# Altium schematic sheet Principal.SCHDOC
size A4
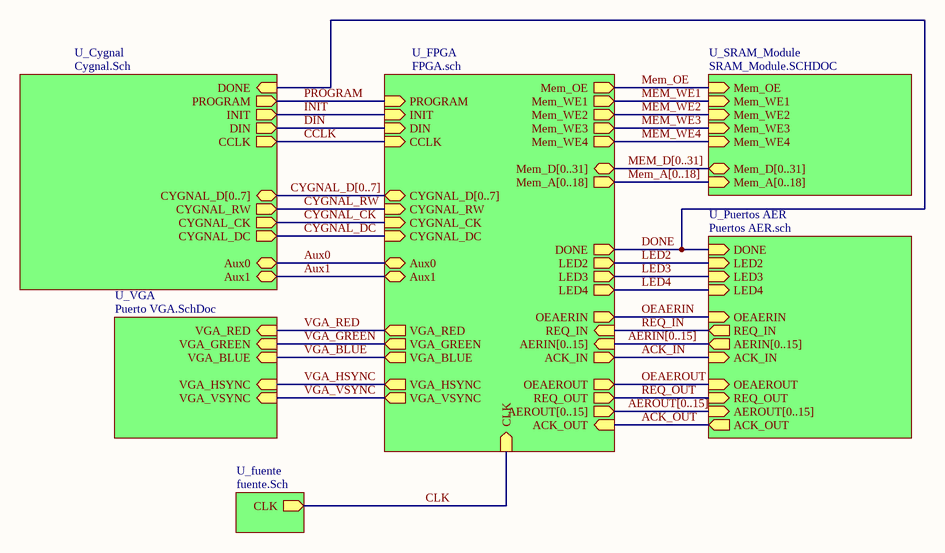
[diagram p0: Principal.SCHDOC]

## Sub-sheets
U_Cygnal = Cygnal.Sch: CYGNAL_D[0..7] (bidir), CYGNAL_RW (out), PROGRAM (out), INIT (out), CYGNAL_CK (out), CYGNAL_DC (out), DIN (out), CCLK (out), DONE (in), Aux0 (bidir), Aux1 (bidir)
U_FPGA = FPGA.sch: ACK_IN (out), REQ_IN (in), REQ_OUT (out), ACK_OUT (in), OEAEROUT (out), LED2 (out), LED3 (out), LED4 (out), PROGRAM (in), AERIN[0..15] (in), AEROUT[0..15] (out), CLK (in), INIT (in), OEAERIN (out), Mem_WE1 (out), Mem_OE (out), CYGNAL_D[0..7] (bidir), Mem_WE2 (out), Mem_WE3 (out), Mem_WE4 (out), CYGNAL_RW (in), CYGNAL_CK (in), CYGNAL_DC (in), Mem_D[0..31] (bidir), Mem_A[0..18] (out), CCLK (in), DONE (out), DIN (in), Aux0 (bidir), Aux1 (bidir), VGA_RED (out), VGA_GREEN (out), VGA_HSYNC (out), VGA_VSYNC (out), VGA_BLUE (out)
U_fuente = fuente.Sch: CLK (out)
U_Puertos AER = Puertos AER.sch: AERIN[0..15] (out), AEROUT[0..15] (in), DONE (in), LED2 (in), LED3 (in), LED4 (in), OEAERIN (in), OEAEROUT (in), ACK_IN (in), REQ_OUT (in), REQ_IN (out), ACK_OUT (out)
U_SRAM_Module = SRAM_Module.SCHDOC: Mem_WE1 (in), Mem_OE (in), Mem_A[0..18] (in), Mem_D[0..31] (bidir), Mem_WE2 (in), Mem_WE3 (in), Mem_WE4 (in)
U_VGA = Puerto VGA.SchDoc: VGA_HSYNC (in), VGA_RED (in), VGA_VSYNC (in), VGA_GREEN (in), VGA_BLUE (in)

## Nets
ACK_IN: sheet U_FPGA/ACK_IN, sheet U_Puertos AER/ACK_IN
ACK_OUT: sheet U_FPGA/ACK_OUT, sheet U_Puertos AER/ACK_OUT
Aux0: sheet U_Cygnal/Aux0, sheet U_FPGA/Aux0
Aux1: sheet U_Cygnal/Aux1, sheet U_FPGA/Aux1
CCLK: sheet U_Cygnal/CCLK, sheet U_FPGA/CCLK
CLK: sheet U_FPGA/CLK, sheet U_fuente/CLK
CYGNAL_CK: sheet U_Cygnal/CYGNAL_CK, sheet U_FPGA/CYGNAL_CK
CYGNAL_DC: sheet U_Cygnal/CYGNAL_DC, sheet U_FPGA/CYGNAL_DC
CYGNAL_RW: sheet U_Cygnal/CYGNAL_RW, sheet U_FPGA/CYGNAL_RW
DIN: sheet U_Cygnal/DIN, sheet U_FPGA/DIN
DONE: sheet U_Cygnal/DONE, sheet U_FPGA/DONE, sheet U_Puertos AER/DONE
INIT: sheet U_Cygnal/INIT, sheet U_FPGA/INIT
LED2: sheet U_FPGA/LED2, sheet U_Puertos AER/LED2
LED3: sheet U_FPGA/LED3, sheet U_Puertos AER/LED3
LED4: sheet U_FPGA/LED4, sheet U_Puertos AER/LED4
Mem_OE: sheet U_FPGA/Mem_OE, sheet U_SRAM_Module/Mem_OE
MEM_WE1: sheet U_FPGA/Mem_WE1, sheet U_SRAM_Module/Mem_WE1
MEM_WE2: sheet U_FPGA/Mem_WE2, sheet U_SRAM_Module/Mem_WE2
MEM_WE3: sheet U_FPGA/Mem_WE3, sheet U_SRAM_Module/Mem_WE3
MEM_WE4: sheet U_FPGA/Mem_WE4, sheet U_SRAM_Module/Mem_WE4
OEAERIN: sheet U_FPGA/OEAERIN, sheet U_Puertos AER/OEAERIN
OEAEROUT: sheet U_FPGA/OEAEROUT, sheet U_Puertos AER/OEAEROUT
PROGRAM: sheet U_Cygnal/PROGRAM, sheet U_FPGA/PROGRAM
REQ_IN: sheet U_FPGA/REQ_IN, sheet U_Puertos AER/REQ_IN
REQ_OUT: sheet U_FPGA/REQ_OUT, sheet U_Puertos AER/REQ_OUT
VGA_BLUE: sheet U_FPGA/VGA_BLUE, sheet U_VGA/VGA_BLUE
VGA_GREEN: sheet U_FPGA/VGA_GREEN, sheet U_VGA/VGA_GREEN
VGA_HSYNC: sheet U_FPGA/VGA_HSYNC, sheet U_VGA/VGA_HSYNC
VGA_RED: sheet U_FPGA/VGA_RED, sheet U_VGA/VGA_RED
VGA_VSYNC: sheet U_FPGA/VGA_VSYNC, sheet U_VGA/VGA_VSYNC

## Buses and harness runs
bus AERIN[0..15] = sheet U_FPGA/AERIN[0..15] = sheet U_Puertos AER/AERIN[0..15]
bus AEROUT[0..15] = sheet U_FPGA/AEROUT[0..15] = sheet U_Puertos AER/AEROUT[0..15]
bus CYGNAL_D[0..7] = sheet U_Cygnal/CYGNAL_D[0..7] = sheet U_FPGA/CYGNAL_D[0..7]
bus Mem_A[0..18] = sheet U_FPGA/Mem_A[0..18] = sheet U_SRAM_Module/Mem_A[0..18]
bus MEM_D[0..31] = sheet U_FPGA/Mem_D[0..31] = sheet U_SRAM_Module/Mem_D[0..31]